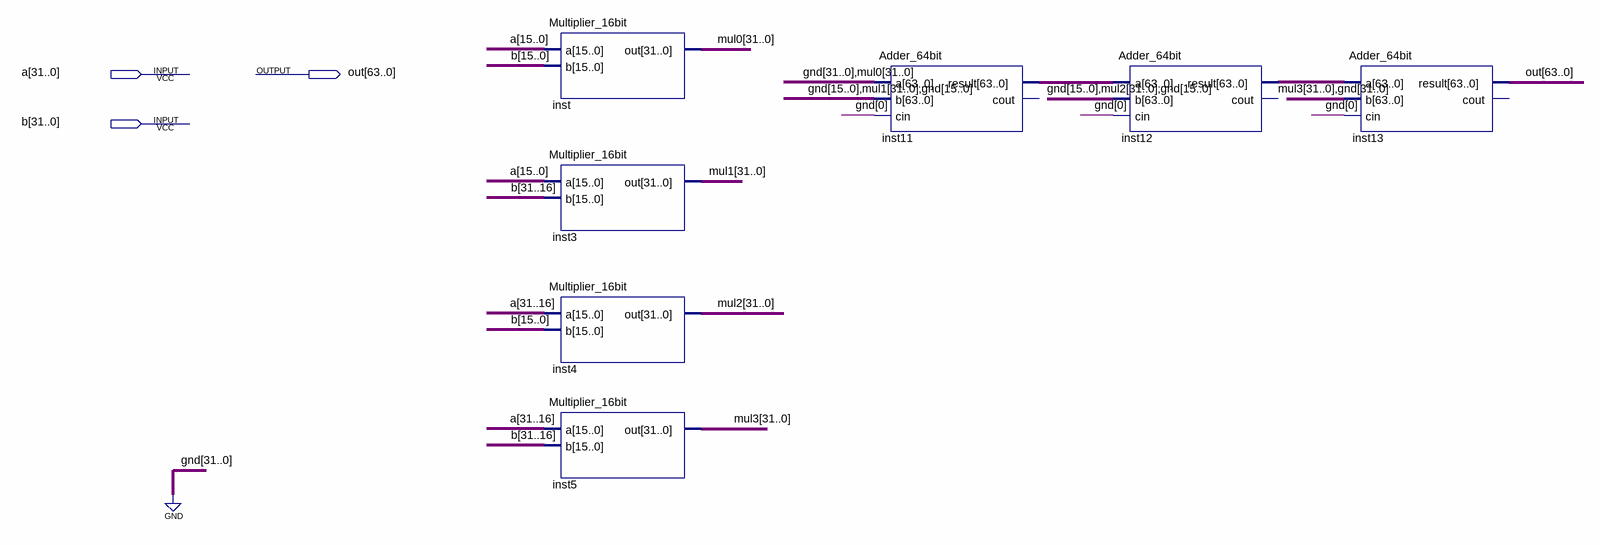
[diagram p0: schematic sheet]
// Quartus schematic Multiplier_32bit.bdf as structural Verilog: 7 symbols, 3 pins
module Multiplier_32bit (
  input  [31:0] a,
  input  [31:0] b,
  output [63:0] out
);

  wire [31:0] mul0, mul1, mul2, mul3;
  wire [63:0] inst11_result, inst12_result;

  Multiplier_16bit inst (.a(a[15:0]), .b(b[15:0]), .out(mul0));
  Multiplier_16bit inst3 (.a(a[15:0]), .b(b[31:16]), .out(mul1));
  Multiplier_16bit inst4 (.a(a[31:16]), .b(b[15:0]), .out(mul2));
  Multiplier_16bit inst5 (.a(a[31:16]), .b(b[31:16]), .out(mul3));
  Adder_64bit inst11 (
    .a({{32{1'b0}}, mul0}), .b({{16{1'b0}}, mul1, {16{1'b0}}}), .cin(1'b0), .result(inst11_result));  // open: cout
  Adder_64bit inst12 (
    .a(inst11_result), .b({{16{1'b0}}, mul2, {16{1'b0}}}), .cin(1'b0), .result(inst12_result));  // open: cout
  Adder_64bit inst13 (.a(inst12_result), .b({mul3, {32{1'b0}}}), .cin(1'b0), .result(out));  // open: cout
endmodule
